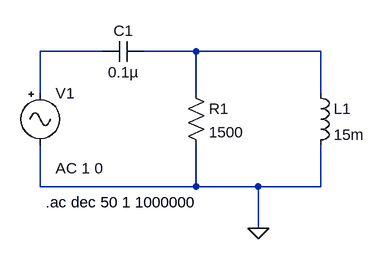
[diagram p0: schematic P1b.asc]
P1b.asc, the LTspice schematic file:
Version 4.1
SHEET 1 880 680
WIRE 112 112 16 112
WIRE 256 112 176 112
WIRE 448 112 256 112
WIRE 16 176 16 112
WIRE 256 176 256 112
WIRE 448 176 448 112
WIRE 16 320 16 256
WIRE 256 320 256 256
WIRE 256 320 16 320
WIRE 352 320 256 320
WIRE 448 320 448 256
WIRE 448 320 352 320
WIRE 352 384 352 320
FLAG 352 384 0
SYMBOL Misc\\signal 16 160 R0
WINDOW 123 24 132 Left 2
WINDOW 39 0 0 Left 0
SYMATTR InstName V1
SYMATTR Value ""
SYMATTR Value2 AC 1 0
SYMBOL res 240 160 R0
SYMATTR InstName R1
SYMATTR Value 1500
SYMBOL cap 176 96 R90
WINDOW 0 0 32 VBottom 2
WINDOW 3 32 32 VTop 2
SYMATTR InstName C1
SYMATTR Value 0.1µ
SYMBOL ind 432 160 R0
SYMATTR InstName L1
SYMATTR Value 15m
SYMATTR SpiceLine Rser=1m
TEXT 24 344 Left 2 !.ac dec 50 1 1000000

The netlist it stands for:
* P1b.asc
V1 N001 0 AC 1 0
R1 N002 0 1500
C1 N002 N001 0.1µ
L1 N002 0 15m Rser=1m
.ac dec 50 1 1000000
.backanno
.end